# EAGLE board 090559_Sceptre (EAGLE 5.10)
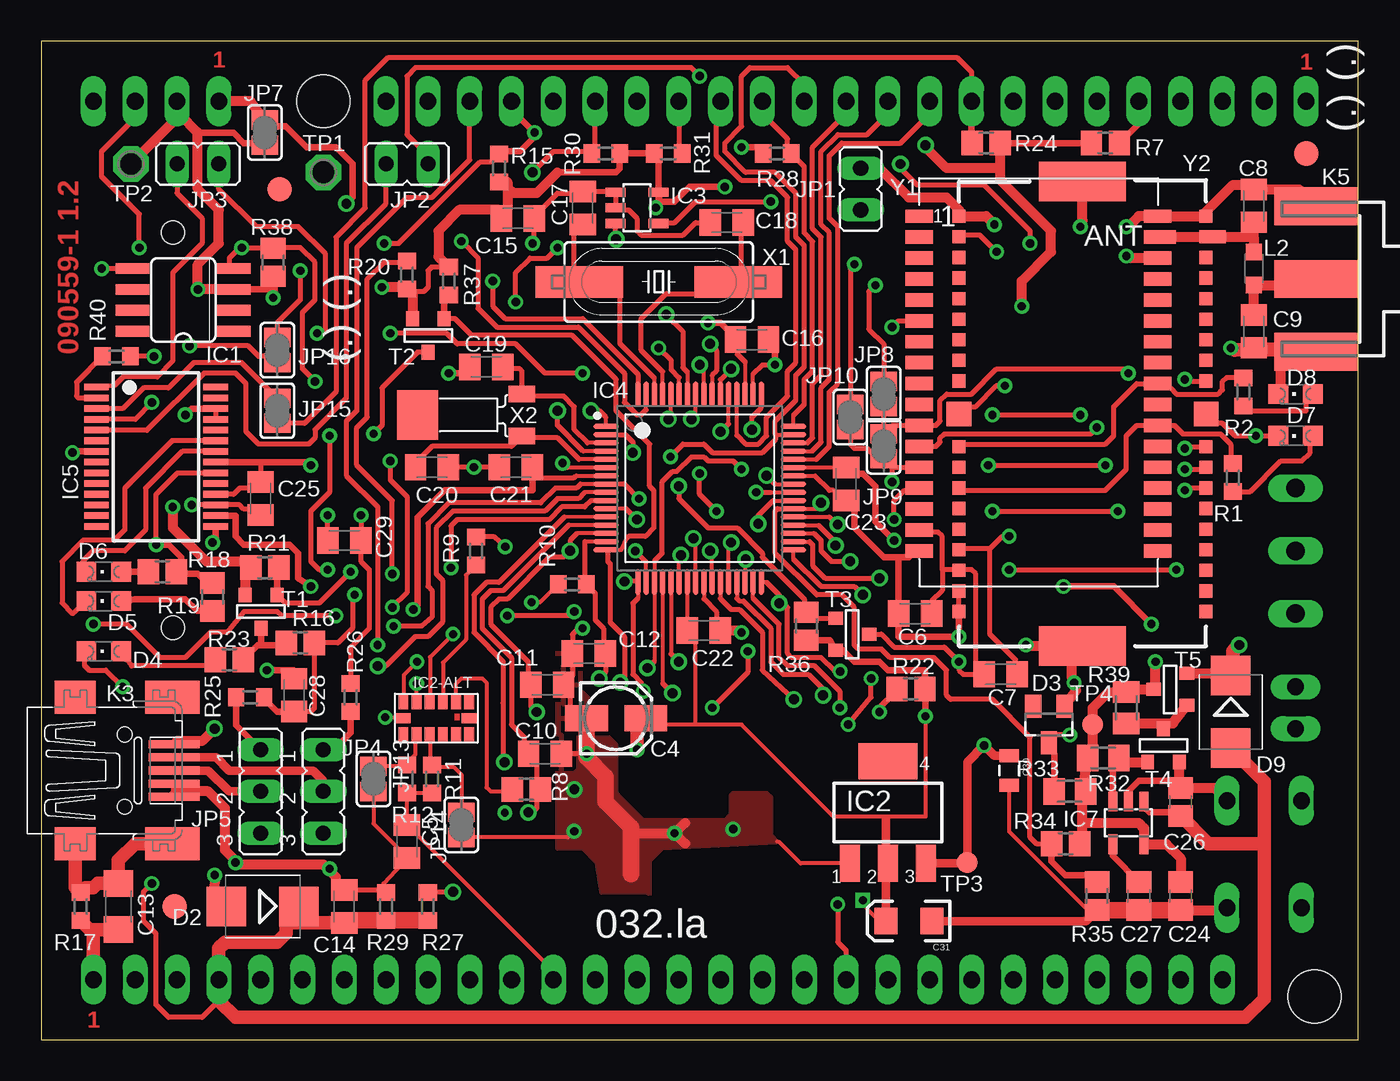
[diagram p7: board, top side]
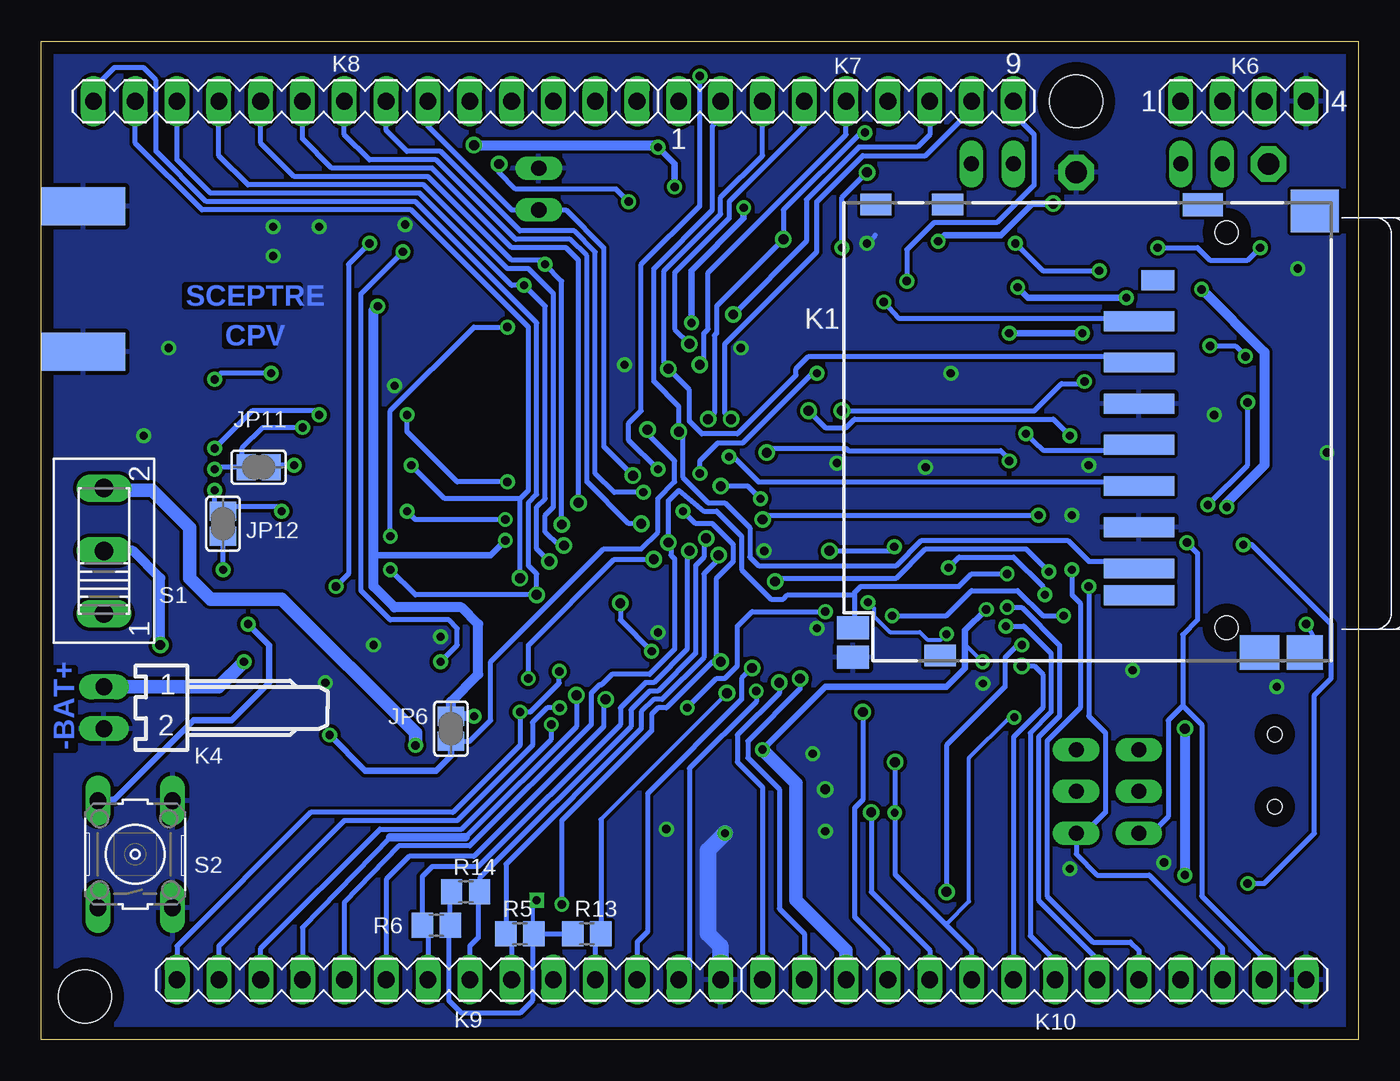
[diagram p8: board, bottom side, seen from below]

Size 80 x 60.63 mm. Coordinates in mm from the lower left corner, seen from the top.
Outline: 0,0 79.99,0 79.99,60.63 0,60.63 0,0
Copper layers (1*16): Top 0.035mm / dielectric 1.5mm / Bottom 0.035mm
Design rules "default *": minimum track width 10mil, minimum drill 19mil, track to track 8mil, track to pad 7mil, pad to pad 6mil, via to via 8mil, smd to smd 8mil, copper to edge 30mil, drill to drill 8mil, minimum pad ring 10mil, minimum via ring 8mil, stop-mask expansion 4mil, vias tented up to drill 20mil, thermal gap 10mil
Net classes: 1 +5V: width 1.016 mm, drill 0.61 mm, clearance 0.61 mm; 2 +3V3: width 0.762 mm, drill 0.508 mm
Holes 3.2 mm at 17.14,56.98 77.34,2.63

## Footprints (pad centres in the part's own frame; a part is rotated, then mirrored left to right if it is on the bottom)
153CLV-0405 = smd 2.6 x 1.6: + 1.8,0; - -1.8,0
C0805K = smd 1.3 x 1.6: 1 -1,0; 2 1,0
C1206 = smd 1.6 x 1.8: 1 -1.4,0; 2 1.4,0
C0805 = smd 1.3 x 1.5: 1 -0.85,0; 2 0.85,0
0805 = smd 0.8 x 1.2: 1 -0.9,0; 2 0.9,0
EIA3216 = smd 1.4 x 1.6: A 1.4,0; C -1.4,0
SMB = smd 2.4 x 2.4: A 2.2,0; C -2.2,0
SOT23 = smd 1 x 1.4: 1 -0.95,-1.1; 2 0.95,-1.1; 3 0,1.1
CHIPLED_0805 = smd 1.2 x 1.2: A 0,-1.05; C 0,1.05
SO08 = smd 0.66 x 2.032: 1 -1.905,-3.073; 2 -0.635,-3.073; 3 0.635,-3.073; 4 1.905,-3.073; 5 1.905,3.073; 6 0.635,3.073; 7 -0.635,3.073; 8 -1.905,3.073
SOT223 = smd 1.219 x 2.235: 1 -2.311,-3.099; 2 0,-3.099; 3 2.311,-3.099 | smd 3.6 x 2.2: 4 0,3.099
LGA14 = smd 0.9 x 0.6: 1 1,-2; 2 1,-1.2; 3 1,-0.4; 4 1,0.4; 5 1,1.2; 6 1,2; 8 -1,2; 9 -1,1.2; 10 -1,0.4; 11 -1,-0.4; 12 -1,-1.2; 13 -1,-2 | smd 0.6 x 0.9: 7 0,2; 14 0,-2
SOT23-5L = smd 0.55 x 1.2: 1 -0.95,-1.3; 2 0,-1.3; 3 0.95,-1.3; 4 0.95,1.3; 5 -0.95,1.3
TSQFP50P1200X1200X160-64N = smd 1.55 x 0.3: 1 -5.7,3.75; 2 -5.7,3.25; 3 -5.7,2.75; 4 -5.7,2.25; 5 -5.7,1.75; 6 -5.7,1.25; 7 -5.7,0.75; 8 -5.7,0.25; 9 -5.7,-0.25; 10 -5.7,-0.75; 11 -5.7,-1.25; 12 -5.7,-1.75; 13 -5.7,-2.25; 14 -5.7,-2.75; 15 -5.7,-3.25; 16 -5.7,-3.75; 33 5.7,-3.75; 34 5.7,-3.25; 35 5.7,-2.75; 36 5.7,-2.25; 37 5.7,-1.75; 38 5.7,-1.25; 39 5.7,-0.75; 40 5.7,-0.25; 41 5.7,0.25; 42 5.7,0.75; 43 5.7,1.25; 44 5.7,1.75; 45 5.7,2.25; 46 5.7,2.75; 47 5.7,3.25; 48 5.7,3.75 | smd 0.3 x 1.55: 17 -3.75,-5.7; 18 -3.25,-5.7; 19 -2.75,-5.7; 20 -2.25,-5.7; 21 -1.75,-5.7; 22 -1.25,-5.7; 23 -0.75,-5.7; 24 -0.25,-5.7; 25 0.25,-5.7; 26 0.75,-5.7; 27 1.25,-5.7; 28 1.75,-5.7; 29 2.25,-5.7; 30 2.75,-5.7; 31 3.25,-5.7; 32 3.75,-5.7; 49 3.75,5.7; 50 3.25,5.7; 51 2.75,5.7; 52 2.25,5.7; 53 1.75,5.7; 54 1.25,5.7; 55 0.75,5.7; 56 0.25,5.7; 57 -0.25,5.7; 58 -0.75,5.7; 59 -1.25,5.7; 60 -1.75,5.7; 61 -2.25,5.7; 62 -2.75,5.7; 63 -3.25,5.7; 64 -3.75,5.7
SSOP28 = smd 0.4 x 1.5: 1 -4.225,-3.625; 2 -3.575,-3.625; 3 -2.925,-3.625; 4 -2.275,-3.625; 5 -1.625,-3.625; 6 -0.975,-3.625; 7 -0.325,-3.625; 8 0.325,-3.625; 9 0.975,-3.625; 10 1.625,-3.625; 11 2.275,-3.625; 12 2.925,-3.625; 13 3.575,-3.625; 14 4.225,-3.625; 15 4.225,3.625; 16 3.575,3.625; 17 2.925,3.625; 18 2.275,3.625; 19 1.625,3.625; 20 0.975,3.625; 21 0.325,3.625; 22 -0.325,3.625; 23 -0.975,3.625; 24 -1.625,3.625; 25 -2.275,3.625; 26 -2.925,3.625; 27 -3.575,3.625; 28 -4.225,3.625
JP1 = drill 0.914 long: 1 0,-1.27; 2 0,1.27
JP2 = drill 0.914 long: 1 -2.54,0; 2 0,0; 3 2.54,0
SJ = smd 1.168 x 1.6: 1 -0.762,0; 2 0.762,0
SDBMF-009XXBXX2 = smd 1.2 x 4.3: 1 6.7,5.325; 2 4.2,5.325; 3 1.7,5.325; 4 -0.8,5.325; 5 -3.3,5.325; 6 -5.8,5.325; 7 -8.3,5.325; 8 -9.925,5.325 | smd 1.2 x 2: 9 9.2,4.175 | smd 1.397 x 2.413: 10 13.787,1.457 | smd 2.1 x 2.4: M1 -13.4,-2 | smd 2.6 x 2.9: M2 13.4,-5.35 | smd 1.3 x 1.9: M3 -13.6,17.4; M4 13.8,16.95; M5 13.8,21.3 | smd 1.4 x 1.95: SW1 -11.9,22.7; SW3 -13.7,22.7 | smd 2.1 x 2.2: SW2 -13.4,-4.75 | hole 1.4: -11.9,0; 12.1,0
32005-201 = smd 3.1 x 0.5: 1 3,1.6; 2 3,0.8; 3 3,0; 4 3,-0.8; 5 3,-1.6 | smd 2.5 x 2: M1 -3,-4.45; M2 -3,4.45 | smd 3.3 x 2: M3 2.9,4.45; M4 2.9,-4.45 | hole 0.9: 0,2.2; 0,-2.2
7395-02 = drill 1.016 long: 1 1.27,0; 2 -1.27,0
J502-ND-142-0701-871/876 = smd 5.08 x 2.286: 1 2.565,0; G@1 2.565,4.42; G@2 2.565,-4.42 | smd 5.08 x 2.286 bottom: G@3 2.565,4.42; G@4 2.565,-4.42
MA04-1 = drill 1.016 long: 1 -3.81,0; 2 -1.27,0; 3 1.27,0; 4 3.81,0
MA09-1 = drill 1.016 long: 1 -10.16,0; 2 -7.62,0; 3 -5.08,0; 4 -2.54,0; 5 0,0; 6 2.54,0; 7 5.08,0; 8 7.62,0; 9 10.16,0
MA14-1 = drill 1.016 long: 1 -15.24,0; 2 -12.7,0; 3 -10.16,0; 4 -7.62,0; 5 -5.08,0; 6 -2.54,0; 7 0,0; 8 2.54,0; 9 5.08,0; 10 7.62,0; 11 10.16,0; 12 12.7,0; 13 15.24,0; 14 17.78,0
L2012C = smd 1 x 1: 1 -1,0; 2 1,0
R0603 = smd 1 x 1.1: 1 -0.85,0; 2 0.85,0
R0805 = smd 1.3 x 1.5: 1 -0.85,0; 2 0.85,0
M0805 = smd 1.3 x 1.6: 1 -0.95,0; 2 0.95,0
255SB = drill 1.118 long: 1 -3.81,0; 2 0,0; 3 3.81,0
B3F-10XX = drill 1.016 long: 1 -3.251,2.261; 2 3.251,2.261; 3 -3.251,-2.261; 4 3.251,-2.261
SOT-23 = smd 0.787 x 0.889: 1 0.025,-1.016; 2 -0.94,1.016; 3 0.991,1.016
P1-13 = drill 1.321 pad 2.159 octagon: TP 0,0
B1,27 = smd 1.27 x 1.27: TP 0,0
FIDUCIAL-1.5X3 = smd 1.5 x 1.5: 1 0,0
HC49UP = smd 5.334 x 1.93: 1 -4.826,0; 2 4.826,0
WATCH_XTAL_1 = smd 1.6 x 1: P$1 0,1.27; P$2 0,-1.27 | smd 2.5 x 3: P$3 -6.35,0
BTM-112 = smd 1.676 x 0.813: 1 0,20.32; 2 0,19.05; 3 0,17.78; 4 0,16.51; 5 0,15.24; 6 0,13.97; 7 0,12.7; 8 0,11.43; 9 0,10.16; 10 0,8.89; 11 0,7.62; 12 0,6.35; 13 0,5.08; 14 0,3.81; 15 0,2.54; 16 0,1.27; 17 0,0; 18 14.478,0; 19 14.478,1.27; 20 14.478,2.54; 21 14.478,3.81; 22 14.478,5.08; 23 14.478,6.35; 24 14.478,7.62; 25 14.478,8.89; 26 14.478,10.16; 27 14.478,11.43; 28 14.478,12.7; 29 14.478,13.97; 30 14.478,15.24; 31 14.478,16.51; 32 14.478,17.78; 34 14.478,20.32 | smd 1.93 x 0.813: 33 14.605,19.05
BTM-22X = smd 0.8 x 0.8: 1 0,0; 2 0,-1.25; 3 0,-2.5; 4 0,-3.75; 5 0,-5; 6 0,-6.25; 7 0,-7.5; 8 0,-8.75; 9 0,-10; 11 0,-14; 12 0,-15.25; 13 0,-16.5; 14 0,-17.75; 15 0,-19; 16 0,-20.25; 17 0,-21.5; 18 0,-22.75; 19 0,-24; 20 15,-24; 21 15,-22.75; 22 15,-21.5; 23 15,-20.25; 24 15,-19; 25 15,-17.75; 26 15,-16.5; 27 15,-15.25; 28 15,-14; 30 15,-10; 31 15,-8.75; 32 15,-7.5; 33 15,-6.25; 34 15,-5; 35 15,-3.75; 36 15,-2.5; 38 15,0 | smd 1.5 x 1.5: 10 0,-12; 29 15,-12 | smd 1.6 x 0.8: 37 15.4,-1.25 | smd 5.3 x 2.4: 39 7.5,2.1; 40 7.5,-26.1

## Placement (x,y rotation side)
C4  4u7 6V3  [153CLV-0405]  34.92,19.52 0 top
C5  100n  [C0805K]  22.22,12.03 270 top
C6  100n  [C0805K]  53.08,25.87 0 top
C7  220n  [C0805K]  58.29,22.19 180 top
C8  [C0805K]  73.66,50.64 90 top
C9  [C0805K]  73.66,43.02 270 top
C10  100n  [C0805K]  30.6,17.36 180 top
C11  100n  [C0805K]  30.73,21.55 180 top
C12  100n  [C0805K]  33.27,23.46 0 top
C13  10n 500V  [C1206]  4.69,8.09 270 top
C14  100n  [C0805K]  18.41,8.09 270 top
C15  100n  [C0805K]  28.95,49.87 180 top
C16  100n  [C0805K]  43.17,42.51 0 top
C17  18p  [C0805K]  32.89,50.51 90 top
C18  18p  [C0805K]  41.65,49.62 180 top
C19  22p  [C0805K]  27.05,40.86 180 top
C20  22p  [C0805K]  23.74,34.76 0 top
C21  100n  [C0805K]  28.82,34.76 180 top
C22  100n  [C0805K]  40.25,24.85 0 top
C23  100n  [C0805K]  48.89,33.74 270 top
C24  1u  [C0805]  69.21,8.73 270 top
C25  100n  [C0805K]  13.33,32.86 270 top
C26  1u  [C0805]  69.21,14.44 90 top
C27  1u  [C0805]  66.67,8.73 270 top
C28  18p  [C0805K]  15.36,20.92 90 top
C29  18p  [C0805K]  18.41,30.32 180 top
C30  [0805]  58.8,16.34 270 top
C31  [EIA3216]  52.7,7.2 180 top
D2  MBRS130LT3  [SMB]  13.46,8.09 180 top
D3  BZX84C39  [SOT23]  61.21,19.14 180 top
D4  [CHIPLED_0805]  3.8,23.58 90 top
D5  [CHIPLED_0805]  3.8,26.63 90 top
D6  [CHIPLED_0805]  3.8,28.41 90 top
D7  [CHIPLED_0805]  76.19,36.66 90 top
D8  [CHIPLED_0805]  76.19,39.2 90 top
D9  MBRS130LT3  [SMB]  72.26,19.9 270 top
IC1  DS18B20Z  [SO08]  8.63,44.92 90 top
IC2  [SOT223]  51.43,13.8 0 top
IC2-ALT  MMA7361L  [LGA14]  24,19.52 90 top
IC3  LM3724-3V08  [SOT23-5L]  36.19,50.51 270 top
IC4  LPC2148FBD64  [TSQFP50P1200X1200X160-64N]  40,33.49 0 top
IC5  FT232RL  [SSOP28]  6.98,35.4 270 top
IC7  MAX1551  [SOT23-5L]  66.03,13.17 180 top
JP1  ISP  [JP1]  49.78,51.65 180 top
JP2  ISP_RX  [JP1]  22.22,53.17 270 top
JP3  ISP_TX  [JP1]  9.52,53.17 270 top
JP4  [JP2]  17.14,15.08 270 top
JP5  [JP2]  13.33,15.08 270 top
JP6  [SJ]  55.11,18.89 90 bottom
JP7  [SJ]  13.58,55.08 270 top
JP8  [SJ]  51.18,39.2 90 top
JP9  [SJ]  51.18,36.03 270 top
JP10  [SJ]  49.14,37.81 90 top
JP11  [SJ]  66.8,34.76 0 bottom
JP12  [SJ]  68.96,31.33 270 bottom
JP13  [SJ]  20.19,15.84 270 top
JP14  [SJ]  25.52,13.04 270 top
JP15  [SJ]  14.35,38.19 270 top
JP16  [SJ]  14.35,41.87 90 top
K1  SDBMF-00915B0T2  [SDBMF-009XXBXX2]  8,36.92 90 bottom
K3  MINI-USB-SCHIELD-32005-201  [32005-201]  5.08,16.34 0 top
K4  22-05-7028-02  [7395-02]  76.19,20.16 90 bottom
K5  SMA-142-0701-801  [J502-ND-142-0701-871/876]  80,46.19 180 top
K6  [MA04-1]  6.98,56.98 0 bottom
K7  [MA09-1]  31.11,56.98 0 bottom
K8  [MA14-1]  61.59,56.98 0 bottom
K9  [MA14-1]  53.97,3.64 180 bottom
K10  [MA14-1]  18.41,3.64 180 bottom
L2  [L2012C]  73.66,46.83 90 top
R1  1k  [R0603]  72.38,34.12 90 top
R2  1k  [R0603]  73.02,39.33 90 top
R5  4k7  [R0805]  50.92,6.44 180 bottom
R6  4k7  [R0805]  56,6.95 180 bottom
R7  NC / DNP  [R0805]  64.64,54.45 0 top
R8  1k  [R0805]  29.46,15.2 0 top
R9  1k  [R0603]  26.41,29.68 90 top
R10  1k  [R0603]  32.25,27.65 0 top
R11  100k  [R0603]  23.74,15.84 270 top
R12  100k  [R0603]  22.22,15.84 270 top
R13  100k  [R0805]  46.86,6.44 0 bottom
R14  100k  [R0805]  54.22,8.98 0 bottom
R15  47k  [R0603]  27.81,52.92 90 top
R16  1k5  [R0805]  15.74,24.09 0 top
R17  1M  [R0603]  2.41,8.09 270 top
R18  1k  [R0805]  7.36,28.41 0 top
R19  1k  [R0805]  10.41,26.89 270 top
R20  1M  [R0603]  22.22,46.44 90 top
R21  1M  [R0805]  13.58,28.66 0 top
R22  1M  [R0805]  52.83,21.3 180 top
R23  1k  [R0805]  11.43,23.08 180 top
R24  4k7  [R0805]  57.4,54.45 180 top
R25  33 R  [R0603]  12.7,20.79 0 top
R26  33 R  [R0603]  18.79,20.79 90 top
R27  10k  [R0603]  23.49,8.09 270 top
R28  100k  [R0603]  44.7,53.81 0 top
R29  100k  [R0603]  20.95,8.09 90 top
R30  100k  [R0603]  34.28,53.81 180 top
R31  100k  [R0603]  38.09,53.81 0 top
R32  100k  [M0805]  64.51,17.11 180 top
R33  1k  [M0805]  62.48,15.08 180 top
R34  330k  [R0805]  62.23,11.9 0 top
R35  1M  [R0805]  64.13,8.73 90 top
R36  1M  [R0805]  46.48,25.11 90 top
R37  1M  [R0603]  24.76,46.06 270 top
R38  4k7  [R0805]  14.09,47.21 270 top
R39  100k  [M0805]  65.91,20.16 90 top
R40  2k2  [R0603]  4.57,41.49 180 top
S1  PWR  [255SB]  76.19,29.68 90 bottom
S2  [B3F-10XX]  74.29,11.27 90 bottom
T1  ZXM61P03F  [SOT-23]  13.33,26 0 top
T2  ZXM61P03F  [SOT-23]  23.49,42.76 0 top
T3  ZXM61P03F  [SOT-23]  49.27,24.6 90 top
T4  FDV301N  [SOT-23]  68.19,17.87 180 top
T5  ZXM61P03F  [SOT-23]  68.58,21.3 270 top
TP1  TPSQPAD1-13  [P1-13]  17.14,52.67 0 top
TP2  TPSQPAD1-13  [P1-13]  5.46,53.17 0 top
TP3  TPSQB1,27  [B1,27]  56.26,10.76 0 top
TP4  TPSQB1,27  [B1,27]  63.88,19.14 0 top
U$1  FIDUCIAL1.5X3  [FIDUCIAL-1.5X3]  8.12,8.09 0 top
U$2  FIDUCIAL1.5X3  [FIDUCIAL-1.5X3]  76.83,53.81 0 top
U$3  FIDUCIAL1.5X3  [FIDUCIAL-1.5X3]  14.47,51.65 0 top
X1  12 MHz  [HC49UP]  37.51,46.01 180 top
X2  32.768 kHz  [WATCH_XTAL_1]  29.2,37.94 0 top
Y1  BTM-112  [BTM-112]  53.34,29.68 0 top
Y2  BTM-222  [BTM-22X]  55.75,50 0 top

## Tracks (layer width: path | path; a pad name or v marks a point on that pad's centre or on a via)
+3V3  (via drill 0.48, 0.5, 0.6)
  Top 0.254: 42.75,41.15 IC4.51 | 39.25,25.1 IC4.23 | 32.49,34.24 IC4.7 | C23.1 IC4.43 | v22.83,22.95 22.02,22.14 22.02,20.54 IC2-ALT.6 | R11.2 23.74,15 22.22,15 R12.2 C5.1 22.32,12.97 31.01,4.28 K10.12 31.11,4.92 | IC2.2 51.43,7.33 C31.A 50.92,7.2 50.16,7.96 50.16,8.22 v49.91,8.47 | 39.75,19.14 42.54,19.14 48.13,13.55 51.43,13.55 | 39.75,19.14 37.1,19.14 C4.+ | 39.75,24.36 C22.1 39.75,24.24 39.75,19.14 | 51.43,13.55 53.72,13.55 v53.72,19.65 | 51.43,13.55 51.3,13.42
  Top 0.305: 42.75,41.15 42.29,41.62 42.29,42.4 C16.1 41.78,43.02 | T3.2 48.69,23.66 | C22.1 39.25,25.1 | R37.1 23.7,46.91 23.49,46.7 23.49,45.68 23.24,45.43 22.39,45.43 R20.1 | 32.49,34.24 32.38,34.12 30.35,34.12 30.35,34.24 C21.1 | R38.2 14.09,45.43 13.96,45.55 | IC3.5 37.46,50.92 | 49.26,34.38 C23.1
  Top 0.406: R36.1 47.91,24.26 T3.2 | 13.96,45.55 IC1.3 | 31.36,52.67 34.92,52.67 35.13,52.88 R30.1 R31.1 37.49,53.56 IC3.5 | 48.69,23.66 49.4,22.95 50.92,22.95 51.43,22.44 53.68,22.44 R22.1 53.72,21.3 v53.72,19.65 | v51.81,30.32 50.67,31.46 50.67,33.62 49.91,34.38 49.26,34.38 | 27.81,50.38 27.95,50.24 C15.2 27.95,50.02 28.32,50.38 | R15.1 28.32,52.07 | R24.1 R7.1 | 22.39,45.43 22.55,45.26 | v40.51,43.52 41.27,43.52 41.78,43.02 | IC3.5 37.49,50.67 v37.33,50.51 | 9.52,55.08 11.68,55.08 12.31,54.45 13.33,54.45 JP7.2 | R20.1 22.13,45.68 | v42.54,54.19 43.72,54.19 R28.1 | v22.6,26.12 22.86,26.38 22.86,31.71 24.51,33.36 29.84,33.36 29.84,34.74 C21.1 | v41.52,51.78 39.37,51.78 38.48,50.89 37.55,50.89 IC3.5
  Top 0.508: 51.3,13.42 C31.A
  Top 0.61: IC1.3 v9.52,45.55 9.52,47.08 10.79,48.35 10.79,50.38 9.52,51.65 9.52,55.08 8.44,56.16 | 8.44,56.16 8.25,56.35 K6.2 | R15.1 28.74,51.4 30.09,51.4 31.36,52.67 | 27.81,50.38 25.39,50.38 24.12,49.11 24.12,47.55 R37.1 | 28.32,52.07 28.32,50.38 | v59.56,44.54 59.56,46.06 61.34,47.84 61.34,49.11 58.25,52.2 58.25,52.92 | 58.25,52.92 R24.1 | 22.55,45.26 T2.2 | v14.09,45.05 R38.2 | 22.13,45.68 v20.7,45.68 | v8,32.35 8,31.08 10.03,29.05 12.35,29.05 R21.1 12.39,28.32 T1.2 | v53.72,54.32 53.84,54.06 54.99,52.92 58.25,52.92 | 8.44,56.16 TP2.TP
  Top 0.813: v36.19,17.62 36.19,18.99 C4.+
  Bottom 0.254: v22.83,22.95 23.72,23.84 23.9,23.84 | 50.16,6.35 50.16,8.22 v49.91,8.47
  Bottom 0.305: R14.1 55.15,8.9 R6.1 55.15,6.53 55.24,6.44 55.24,2.38 54.48,1.61 50.92,1.61 50.16,2.38 50.16,6.35 R5.1 R13.1
  Bottom 0.406: v51.81,30.32 52.7,29.43 59.81,29.43 | v40.51,43.52 40.51,46.7 37.33,49.87 v37.33,50.51 | v14.09,45.05 20.06,45.05 v20.7,45.68 | 8,32.6 v8,32.35 | v41.52,51.78 41.52,53.17 v42.54,54.19 | v22.6,26.12 23.9,24.85 23.9,23.84 23.9,22.54 25.01,21.43 32.38,21.43 v36.19,17.62
  Bottom 0.61: v53.72,19.65 JP6.2 55.11,20.54 53.46,22.19 53.46,25.23 54.48,26.25 58.54,26.25 59.81,27.52 59.81,29.43 59.81,44.29 v59.56,44.54 | 8,32.6 5.71,34.89 5.71,41.75 v9.52,45.55 | v42.54,54.19 42.67,54.32 v53.72,54.32
  Bottom 0.813: v36.19,17.62 34.16,15.58 34.16,8.47 31.11,5.42 K10.12
+5V  (via drill 0.5)
  Top 0.305: IC5.20 8.29,34.42 6.98,33.11 v6.98,30.06 | v6.73,9.49 6.22,8.98 6.22,7.2 6.98,6.44 6.98,2.12 7.74,1.36 9.77,1.36 10.79,2.38
  Top 0.406: IC7.1 67.02,14.44 67.02,14.1 67.31,13.8 69,13.8 C26.1 | v6.98,30.06 7.74,30.06 8.5,29.3 8.5,28.45 R18.2 8.59,28.28 9.52,28.28 10.07,27.74 R19.1
  Top 0.813: 74.29,11.9 74.29,2.5 73.15,1.36 11.81,1.36 10.79,2.38 K10.4 10.79,5.55 11.17,5.93 14.35,5.93 14.89,6.48 14.89,7.46 | 14.89,7.46 D2.C | C14.2 15.26,7.09 14.89,7.46 | 74.29,11.9 70.9,11.9 C26.1 | 74.29,11.9 74.29,15.67 D9.A
  Top 1.016: C14.2 18.56,7.24 R29.1 R27.2
  Bottom 0.305: v6.98,30.06 6.47,30.06 1.65,25.23 1.65,21.93 2.66,20.92 2.66,12.54 5.71,9.49 v6.73,9.49
/POK
  Top 0.406: IC7.3 65.09,16.98 R32.1
  Top 0.61: T4.3 65.46,16.85 R32.1
ANTENNA
  Top 0.61: K5.1 77.08,45.83 L2.1 C9.1
BATTERY  (via drill 0.5)
  Top 0.406: IC7.5 66.98,11.8
  Top 0.61: 63.24,13.17 66.67,13.17 66.98,12.86 IC7.5 68.35,11.87 69.21,11.01 C24.1 | 63.24,13.17 63.24,15.01 R33.1 63.31,15.21 R32.2 63.88,17.42 TP4.TP 63.88,20.16 64.83,21.11 R39.2 65.82,21.27 T5.1 67.69,21.4 v67.69,22.95 | R34.2 63.24,12.07 63.24,13.17
  Bottom 0.813: K4.1 69.21,21.43 v67.69,22.95
BT_RESET  (via drill 0.5)
  Top 0.305: v51.68,43.27 52.06,43.65 Y1.6 | Y2.16 55.82,29.82 57.64,29.82 | 57.64,29.82 57.64,24.62 59.18,23.08 59.18,22.3 C7.1 | 57.64,29.82 58.38,30.57 v58.8,30.57
  Bottom 0.305: v58.8,30.57 58.8,38.19 53.72,43.27 v51.68,43.27
D+  (via drill 0.5)
  Top 0.305: IC4.10 33.41,32.74 33.02,32.35 31.62,32.35 30.86,31.59 25.27,31.59 24.89,31.2 v24.89,28.66 | C28.1 15.38,19.9 16.38,19.9 16.59,20.12 R16.2 18.03,24.09 18.92,24.98 18.92,26.89 v19.05,27.01
  Top 0.406: R25.2 13.55,20.7 14.35,19.9 15.35,19.9 C28.1
  Bottom 0.305: v19.05,27.01 19.17,27.27 19.17,27.52 20.95,29.3 24.25,29.3 v24.89,28.66
D-  (via drill 0.5, 0.6)
  Top 0.254: 35.53,32.24 IC4.11
  Top 0.305: v36.19,31.59 35.53,32.24 | R26.2 18.79,23.84 19.93,24.98 19.93,28.54 19.41,29.06 C29.1 19.44,31.57 v19.43,31.84
  Bottom 0.305: v36.19,31.59 35.81,31.84 v19.43,31.84
DNEG  (via drill 0.5)
  Top 0.406: IC5.16 11.82,31.82 11.81,30.57 12.31,30.06 15.11,30.06 15.62,29.55 15.62,28.03 v16.38,27.52
  Bottom 0.305: K10.3 8.25,5.55 12.7,10 15.87,10 17.14,11.27 JP4.3 16.63,12.54 15.36,13.8 15.36,18.63 16.38,19.65 v16.38,27.52
DPOS  (via drill 0.5)
  Top 0.406: IC5.15 10.61,30.13 v10.41,30.19
  Bottom 0.305: 10.66,20.28 11.55,19.39 11.55,13.55 12.31,12.79 13.08,12.79 JP5.3 | K10.2 5.71,4.92 9.52,8.73 9.52,19.14 10.66,20.28 | 10.66,20.28 10.66,24.6 9.77,25.49 9.77,29.55 v10.41,30.19
GND  (via drill 0.48, 0.5, 0.6)
  Top 0.254: IC4.25 40.25,26.76 | IC4.6 31.94,34.74 | 47.01,34.23 45.71,34.23 | IC4.50 43.25,40.42 | IC4.59 38.75,40.2 | IC4.18 36.75,29.02 | v22.8,21.63 IC2-ALT.5 | 20.8,9.09 20.8,9.48 C5.2 22.17,11.14 20.19,13.12 JP13.2 | JP14.2 32,12.28 v32.38,12.66 | C30.2 58.8,12.64 63.5,7.94 R35.1 | C31.C 54.12,7.2 | IC2.1 46.12,10.71 44.85,11.98 44.7,12.03
  Top 0.305: C14.1 20.8,9.09 R29.2 | IC5.18 11.69,33.12 12.06,33.49 12.96,33.49 C25.1 13.33,35.07 | IC5.26 IC5.25 | C16.2 44.06,42.4 44.17,42.4 | Y2.19 Y2.18 | 53.21,29.81 Y1.17 | C20.2 v26.28,34.76 C21.2 | 40.25,26.76 41.02,26 41.02,24.87 C22.2 | 31.94,34.74 v31.67,35.01 | C11.1 31.51,21.77 | 33.12,17.36 C10.1 | C11.1 31.73,21.31 32.13,20.92 32.13,20.16 32.38,19.9 32.74,19.9 C4.- | C11.1 32.27,22.09 C12.1 32.27,24.62 32.63,24.98 v32.89,24.98 | IC1.5 v3.68,46.83 | C29.2 v17.39,31.84 | 45.71,34.23 IC4.42 | 47.01,34.23 47.87,33.36 48.13,33.36 48.75,33 C23.2 49.4,32.49 | C18.2 39.75,49.62 38.98,48.86 36.44,48.86 36.19,49.11 36.19,49.87 35.68,50.38 35.02,50.38 IC3.2 IC3.1 34.84,51.51 C17.2 32.78,51.4 31.36,51.4 29.95,49.98 C15.1 29.95,48.46 v29.84,48.35 | D4.C 2.63,23.2 2.63,22.73 2.92,22.44 3.93,22.44 v4.95,21.43 | Y2.10 56.19,38.44 56.76,38.44 58.03,39.71 v58.54,39.71 | 43.25,40.42 43.81,40.98 v44.57,40.98 | 38.75,40.2 38.27,40.68 38.27,41.24 v37.51,42 | 36.75,29.02 v36.09,29.68 | Y2.29 70.75,37.92 71.24,37.43 71.75,37.43 72.51,36.66 v73.78,36.66 D7.C | 16.31,35.07 16.31,34.96 v16.38,34.89
  Top 0.406: IC7.2 66.03,15.08 66.67,15.71 69.04,15.71 C26.2 | 71.89,7.88 S2.3 | K3.4 K3.5 8.07,14.9 | 53.21,29.81 52.7,29.3 52.08,29.3 | 49.4,32.49 49.4,31.08 51.18,29.3 52.08,29.3 | Y2.19 v55.75,24.47 52.08,24.47 C6.1 52.08,29.3 | 59.88,23.9 v59.81,23.97 | C19.2 25.66,40.73 25.66,40.62 25.52,40.48 v24.76,40.48 | C28.2 15.35,22.43 v13.71,22.44 | 44.17,42.4 44.57,42 v44.57,40.98 | IC5.7 1.97,35.72 v1.9,35.65 | 16.31,35.07 13.33,35.07 IC5.21 | Y1.17 53.46,29.68 | IC5.26 9.14,38.32 v8.76,37.94
  Top 0.508: C31.C 63.46,7.2 R35.1
  Top 0.61: S2.4 71.26,15.29 C26.2 69.13,15.37 T4.2 | C24.2 71.89,7.88 | K5.G@4 76.41,51.64 C8.2 73.38,51.91 72.38,51.91 70.48,50 Y2.38 Y1.34 66.67,50 66.03,49.37 v65.91,49.37 | 8.07,14.9 8.25,15.08 10.16,15.08 11.17,14.06 11.17,11.52 11.87,10.82 | 11.87,10.82 12.06,10.63 17.14,10.63 17.9,9.87 17.9,9.6 C14.1 | v57.91,49.49 57.4,50 Y2.1 55.75,50.38 54.99,51.14 52.7,51.14 50.92,52.92 JP1.1 | v38.48,12.54 39.11,13.17 | v38.48,12.54 39.11,11.9 | 35.83,12.54 v38.48,12.54 | 59.88,23.9 Y2.40 63.05,23.9 62.61,23.46 62.61,21.93 62.86,21.68 62.86,21.19 D3.1 | v63.11,49.37 63.25,49.74 Y2.39 | 11.87,10.82 v11.81,10.76 | C22.2 42.41,24.85 v42.54,24.73 | 75.31,42.02 C9.2 73.64,42 v72.26,42 72.49,41.77 K5.G@3 77.19,42.02 75.31,42.02 | D8.C 75.15,39.3 75.31,39.46 75.31,42.02 | Y1.32 66.03,47.46 v65.91,47.59
  Top 0.813: C13.2 3.17,6.69 | 3.17,6.69 2.96,6.69 R17.2 | 3.17,6.69 K10.1
  Top 1.016: R35.1 C27.2 C24.2 | C4.- 33.12,17.36 33.12,17.15 34.28,15.98 34.28,14.44 35.83,12.9 35.83,12.54 35.83,10.05
  Bottom 0.305: S2.4 72.03,14.72 | v26.28,34.76 26.41,34.63 | v17.39,31.84 17.65,31.6 | v4.95,21.43 4.69,21.43 | v29.84,48.35 29.33,48.86 | v32.89,24.98 32.89,25.23
  Bottom 0.61: v57.91,49.49 58.03,49.37
  Bottom 1.016: v38.48,12.54 39.49,11.52 39.49,6.44 38.73,5.68 K9.1
  other vias: 62.74,21.68 33.14,17.36 32.38,15.2 42.03,12.79 17.52,10.38
  pour Bottom: 0.12,60.54 79.88,60.54 79.88,0.09 0.12,0.09
  pour Top: 31.36,24.09 31.36,11.65 32.89,11.65 33.78,10.76 34.03,8.98 36.83,8.98 36.95,8.85 36.95,10.88 37.71,11.65 44.7,12.03 44.32,12.41 44.32,14.69 44.06,14.95 42.03,14.95 41.91,14.82 41.91,13.68 41.52,13.3 36.57,13.3 34.92,14.95 34.92,17.87 34.03,18.76 34.03,19.9 32.76,21.17 32.76,23.97 31.49,23.97
N$1
  Top 0.254: IC2-ALT.2 25.22,20.54 25.22,21.63 25.52,21.93 26.79,21.93 27.05,21.68 27.05,15.33 27.3,15.08 28.48,15.08 R8.1 28.59,15.2
N$2
  Top 0.813: K3.M4 5.7,11.89 4.69,10.88 C13.1 3.43,9.49 3.17,9.23 2.7,9.23 R17.1 2.08,9.27 K3.M1
N$3
  Top 0.254: IC2-ALT.3 24.4,22.9 25.8,24.3 25.8,28.21 26.41,28.82 R9.1
N$5  (via drill 0.48)
  Top 0.254: v25.01,24.62 23.62,23.23 23.62,20.54 IC2-ALT.4 | v29.79,26.56 30.3,26.56 31.39,27.65 R10.1
  Bottom 0.254: v25.01,24.62 25.34,24.3 26.18,24.3 26.64,24.75 28.44,24.75 29.41,25.72 29.41,26.18 v29.79,26.56
N$7
  Top 0.61: R39.1 67.94,19.21 | 67.94,19.21 68.74,19.21 T5.3 | T4.1 67.91,19.18 67.94,19.21
N$8
  Top 0.406: IC7.4 65.09,11.16 C27.1
N$9
  Top 0.406: R25.1 11.84,19.1 JP5.1
N$10
  Top 0.406: R26.1 18.79,18.63 17.77,17.62 JP4.1
N$11
  Top 0.406: 13.33,23.97 14.77,23.97 R16.1 | T1.1 13.36,23.99 13.33,23.97 | 13.33,23.97 13.16,23.97 R23.1
N$12
  Top 0.305: R1.1 73.44,33.27 75.31,35.14 76.58,35.14 77.08,35.65 77.08,36.5 D7.A
N$13
  Top 0.305: R2.1 73.23,38.48 73.53,38.19 76.83,38.19 76.83,38.79 D8.A
N$14
  Top 0.508: K3.2 10.62,17.15 11.43,16.34 16.5,16.34 17.14,15.71 JP4.2
N$15
  Top 0.508: K3.3 10.16,16.34 11.43,15.08 JP5.2
N$17
  Top 0.305: 5.11,23.08 D4.A 5.49,22.7 10.03,22.7
  Top 0.406: R23.2 10.41,23.08 10.03,22.7
N$18
  Top 0.305: IC5.3 4.95,38.32 6.22,39.59 7.74,39.59 9.27,41.11 12.19,41.11 JP15.1
N$19
  Top 0.305: JP2.1 20.95,50.76 18.54,48.35 18.54,38.95 16.63,37.05 16.63,36.54 16.25,36.16 13.2,36.16 12.44,36.92 12.44,39.84 11.81,40.48 9.9,40.48 6.42,37 3.53,37 IC5.5
N$20
  Top 0.305: JP3.1 8.25,51.4 9.77,49.87 9.77,48.35 8,46.57 8,41.24 7.06,40.25 4.97,40.25 4.44,39.71 3.4,39.61 IC5.1
N$21
  Top 0.305: IC5.2 2.26,38.97 2.15,39.08 2.15,39.93 R40.2
N$22  (via drill 0.5)
  Top 0.305: v20.19,36.79 20.7,37.3 20.7,39.59 22.86,41.75 T2.1
  Bottom 0.305: 20.06,36.66 v20.19,36.79 19.14,35.8 13.3,35.8 13.08,36.03 12.75,36.31 K1.4
N$23  (via drill 0.5)
  Top 0.305: C7.2 56.78,22.33 | 54.73,28.54 54.73,27.27 54.08,26.62 C6.2 | 54.73,28.54 54.73,30.57 54.48,30.82 53.46,30.82 Y1.16 53.21,31.08 | 54.73,28.54 55.71,28.54 Y2.17 55.78,28.54 56.51,28.54 56.76,28.28 56.76,22.93 C7.2 | Y2.2 55.86,48.86 57.02,48.86 v58.03,47.84 | T3.1 51.02,24.62 51.81,23.84 54.86,23.84 v55.75,22.95 55.75,22.44 56,22.19 C7.2
  Bottom 0.305: v58.03,47.84 60.57,45.3 60.57,27.27 58.8,25.49 55.24,25.49 54.73,24.98 54.73,23.97 v55.75,22.95
N$24  (via drill 0.6)
  Top 0.61: T5.2 72.38,22.24 D9.C
  Top 0.813: 72.38,22.24 72.38,23.57 v72.77,23.97
  Bottom 0.61: v72.77,23.97 72.77,28.03 74.42,29.68 S1.2
N$25  (via drill 0.5)
  Top 0.305: v6.85,41.49 R40.1 | v9.01,42.13 12.57,42.13 13.2,41.49 13.96,41.49 JP16.1
  Bottom 0.305: v9.01,42.13 7.49,42.13 v6.85,41.49
N$28
  Top 0.254: JP13.1 22.14,16.6 R12.1 | 22.78,18.5 IC2-ALT.9 22.73,18.33 22.73,17.31 22.32,16.9 R12.1 | R12.1 22.27,16.8
N$29
  Top 0.254: IC2-ALT.10 23.62,18.5 23.62,16.83 23.74,16.7 R11.1 23.8,16.57 25.04,16.57 25.52,16.09 JP14.1
N$35  (via drill 0.5)
  Top 0.305: C25.2 12.96,32.22 12.31,32.22 12.06,32.47 IC5.17 9.52,32.47 9.27,32.47 v9.14,32.47 | IC5.4 5.72,37.67 v6.73,38.7
  Bottom 0.305: v6.73,38.7 6.73,34.89 v9.14,32.47
N$39
  Top 0.305: D5.C 1.9,25.87 1.27,26.51 1.27,29.05 2.53,30.32 4.44,30.32 5.08,30.95 5.08,33.49 7.95,36.37 IC5.23
N$40
  Top 0.305: D6.C 2.76,28.83 2.53,29.05 3.17,29.68 5.08,29.68 6.34,30.95 6.34,33.49 8.57,35.72 IC5.22
N$41
  Top 0.406: D6.A R18.1
N$42
  Top 0.406: D5.A 5.11,26.67 5.71,26.76 8.76,26.76 9.48,26.04 R19.2
N$47  (via drill 0.5, 0.6)
  Top 0.305: v60.07,48.35 60.07,49.11 57.27,51.91 53.21,51.91 52.19,52.92 v52.19,53.17 | IC3.4 37.55,49.62 38.48,49.62 39.75,50.89 v44.32,50.89
  Top 0.406: v67.43,25.23 65.15,27.52 v62.1,27.52
  Bottom 0.305: v60.07,48.35 61.34,47.08 61.34,28.28 v62.1,27.52 | v44.32,50.89 45.08,51.65 51.18,51.65 52.19,52.67 v52.19,53.17
  Bottom 0.406: S2.2 76.58,14.54 76.32,14.57 75.56,14.57 70.73,19.39 68.45,19.39 66.16,21.68 66.16,23.97 v67.43,25.23
N$48  (via drill 0.5, 0.6)
  Top 0.406: 8.25,18.12 K3.1
  Top 0.61: D2.A 10.5,8.94 v10.54,10 | v10.54,18.89 9.77,18.12 8.25,18.12
  Bottom 0.61: v10.54,18.89 v10.54,10
N$52
  Top 0.254: IC4.61 37.75,40.57
  Top 0.305: 37.75,40.57 36.44,41.87 36.44,43.78 37.97,45.3 42.13,45.3 X1.1 42.54,45.71 42.54,48.86 C18.1
N$53
  Top 0.254: IC4.62 37.25,40.18
  Top 0.305: 32.38,45.96 32.23,45.96 | 37.25,40.18 35.17,42.25 35.17,45.3 32.89,45.3 X1.2 32.38,45.81 32.38,45.96 | C17.1 32.74,49.25 32.38,49.11 32.38,45.96
N$54
  Top 0.254: IC4.5 32.66,35.24
  Top 0.305: 32.66,35.24 31.36,36.54 29.33,36.54 X2.P$2 28.57,36.03 23.74,36.03 22.74,35.03 C20.1
N$55
  Top 0.254: IC4.3 33.19,36.24
  Top 0.305: 33.19,36.24 32.38,37.05 32.38,38.44 31.74,39.08 29.33,39.08 X2.P$1 29.2,40.6 29.08,40.73 28.43,40.73 C19.1
P0.0  (via drill 0.5, 0.6)
  Top 0.254: 37.26,29.1 37.26,27.89 | IC4.19 37.25,22.99
  Top 0.305: JP2.2 23.49,53.68 22.22,54.95 22.22,58.51 22.73,59.02 39.49,59.02 v40,58.51 | 37.26,29.1 37.71,29.55 37.71,33.87 38.35,34.51 38.6,34.51 39.49,35.4 40.25,35.4 40.51,35.14 42.03,35.14 v42.54,34.63 | 37.26,27.89 IC4.19 | 37.25,22.99 v36.83,22.57
  Bottom 0.305: v36.83,22.57 37.46,21.93 37.46,20.66 43.17,14.95 43.17,6.57 43.81,5.93 K9.3 | v40,58.51 40,50.64 43.56,47.08 43.56,38.19 44.32,37.43 44.32,36.41 v42.54,34.63
P0.1  (via drill 0.5, 0.6)
  Top 0.254: IC4.21 38.25,23.43
  Top 0.305: v48.38,8.22 48.38,5.93 48.89,5.42 K9.5 | v41.02,32.09 40,33.11 v40,34.38 | v32.89,40.48 30.6,40.48 28.82,42.25 25.27,42.25 24.63,42.89 v21.2,42.89 | JP3.2 10.79,51.65 13.08,49.37 15.62,49.37 17.27,47.71 17.27,43.14 v16.76,42.89 | 38.25,23.43 v38.73,22.95
  Bottom 0.305: v48.38,8.22 48.38,13.3 42.92,18.76 42.92,19.77 42.54,20.16 42.03,20.16 39.24,22.95 v38.73,22.95 38.98,23.2 38.98,28.03 37.97,29.05 37.97,30.06 39.24,31.33 40.25,31.33 v41.02,32.09 | v40,34.38 40,35.14 38.91,36.23 37.38,36.23 33.14,40.48 v32.89,40.48
  Bottom 0.406: v21.2,42.89 v16.76,42.89
P0.2  (via drill 0.6)
  Top 0.254: IC4.22 38.75,29.41
  Top 0.305: 38.75,29.41 v38.86,29.43
  Bottom 0.305: v38.86,29.43 38.73,29.3 39.75,28.28 39.75,23.2 42.29,20.66 42.79,20.66 43.56,19.9 43.56,18.89 51.77,10.67 R5.2 51.43,6.1 K9.6
P0.3  (via drill 0.6)
  Top 0.254: IC4.26 40.75,29.57
  Top 0.305: 40.75,29.57 v40.63,29.68
  Bottom 0.305: K9.8 56.51,6.61 R6.2 56.85,9.91 56.26,10.5 53.46,10.5 44.83,19.14 44.83,20.16 43.3,21.68 42.79,21.68 40.76,23.71 40.76,29.55 v40.63,29.68
P0.4  (via drill 0.6)
  Top 0.254: IC4.27 41.25,26.78
  Top 0.305: 41.25,26.78 41.91,26.12 42.41,26.12 43.81,24.73 43.81,22.44 v45.72,20.66
  Bottom 0.305: K9.9 59.05,9.74 57.65,11.14 53.72,11.14 45.84,19.01 45.84,20.41 v45.72,20.66
P0.5  (via drill 0.6)
  Top 0.254: IC4.29 42.25,26.8
  Top 0.305: 42.25,26.8 42.38,26.67 42.67,26.63 44.32,24.98 44.32,22.95 45.08,22.19 46.6,22.19 47.49,21.3 v47.49,20.92
  Bottom 0.305: 58.8,12.28 64.13,6.82 K9.11 | v47.49,20.92 47.49,19.01 54.22,12.28
  Bottom 0.508: 54.22,12.28 58.8,12.28
P0.6  (via drill 0.5, 0.6)
  Top 0.254: 42.75,29.13 IC4.30
  Top 0.305: v42.79,29.17 42.75,29.13 | v49.02,19.14 50.41,20.79 v50.41,21.93
  Bottom 0.305: K9.12 66.67,5.55 59.43,12.79 54.48,12.79 49.02,18.25 v49.02,19.14 | v50.41,21.93 50.41,23.97 45.21,29.17 v42.79,29.17
P0.7  (via drill 0.5)
  Top 0.254: 43.25,26.81 IC4.31
  Top 0.305: 43.25,26.81 44.83,25.23 44.83,23.2 45.33,22.7 46.98,22.7 48.51,21.17 v48.51,20.16
  Bottom 0.305: K9.13 69.21,5.68 61.59,13.3 54.73,13.3 50.16,17.87 50.16,19.27 49.27,20.16 v48.51,20.16
P0.8  (via drill 0.5, 0.6)
  Top 0.254: 45.7,29.19 IC4.33
  Top 0.305: v58.8,28.54 v68.96,28.54 | 45.7,29.19 47.37,27.52 49.4,27.52 v49.91,27.01
  Bottom 0.305: K8.1 76.83,57.75 75.56,59.02 73.78,59.02 73.02,58.26 73.02,53.94 69.97,50.89 57.27,50.89 49.91,43.52 49.91,33.11 50.41,32.6 50.41,28.79 49.91,28.28 v49.91,27.01 57.27,27.01 v58.8,28.54 | v68.96,28.54 JP12.2
P0.9  (via drill 0.5, 0.6)
  Top 0.254: IC4.34 46.68,30.24
  Top 0.305: IC4.34 | v57.53,34.89 v64.64,34.89 | 46.68,30.24 46.86,30.06 46.86,28.79 47.62,28.03 v50.92,28.03
  Bottom 0.305: 50.92,32.86 50.41,33.36 50.41,43.27 57.53,50.38 70.23,50.38 74.29,54.45 K8.2 | JP11.2 65.91,34.89 v64.64,34.89 | 50.92,32.86 55.49,32.86 v57.53,34.89 | v50.92,28.03 50.92,32.86
P0.10  (via drill 0.5, 0.6)
  Top 0.254: IC4.35 45.69,30.75 46.93,30.75
  Top 0.305: JP8.2 51.18,42.25 50.28,43.15 50.28,45.44 v50.67,45.81 | 46.93,30.75 47.37,30.32 47.37,29.68 48,29.05 v49.14,29.05
  Bottom 0.305: K8.3 71.75,53.43 69.72,51.4 57.02,51.4 51.43,45.81 v50.67,45.81 49.4,44.54 49.4,32.86 49.91,32.35 49.91,29.81 v49.14,29.05
P0.11  (via drill 0.5, 0.6)
  Top 0.254: IC4.37 47.87,31.74
  Top 0.305: v49.4,47.08 49.14,46.83 JP10.2 | 47.87,31.74 v48.38,31.28
  Top 0.406: R7.2 66.67,55.63 K8.5
  Bottom 0.305: K8.5 66.67,54.45 64.64,52.41 56.51,52.41 51.43,47.33 49.65,47.33 v49.4,47.08 48.38,46.06 v48.38,31.28
P0.12  (via drill 0.6)
  Top 0.254: 45.68,32.22 IC4.38 47.11,32.25
  Top 0.305: R34.1 60.45,11.9 60.07,12.28 60.07,18.38 57.78,20.66 55.24,20.66 54.99,20.92 54.99,22.44 54.22,23.2 51.56,23.2 51.05,23.71 49.65,23.71 49.4,23.97 49.4,26.25 48.64,27.01 47.11,27.01 44.57,29.55 44.57,32.09 44.72,32.24 IC4.38 | 47.11,32.25 v47.37,32.6
  Top 0.406: R34.1 61.38,10.85 62.23,10 63.71,10 R35.2
  Bottom 0.305: K8.6 64.13,54.7 62.35,52.92 56.26,52.92 51.43,48.09 48.13,48.09 47.37,47.33 v47.37,32.6
P0.13  (via drill 0.6)
  Top 0.254: 44.46,32.74 IC4.39
  Top 0.305: v43.56,31.33 43.56,31.84 44.46,32.74
  Bottom 0.305: v43.56,31.33 44.32,31.33 46.86,33.87 46.86,47.59 47.87,48.6 51.18,48.6 56,53.43 60.07,53.43 61.59,54.95 K8.7
P0.14  (via drill 0.6)
  Top 0.254: 44.58,33.74 IC4.41
  Top 0.305: v44.06,34.25 44.58,33.74 | JP15.2 16,37.43 17.9,39.33 17.9,48.73 19.68,50.51 19.68,58.26 21.08,59.65 55.62,59.65 56.51,58.76 K8.9
  Top 0.406: R24.2 56.51,54.48 K8.9
  Bottom 0.305: K8.9 56.51,55.46 51.43,50.38 JP1.2 48.13,50.38 45.84,48.09 45.84,36.03 v44.06,34.25
P0.15
  Top 0.254: IC4.45 46.82,35.74
  Top 0.305: 46.82,35.74 47.37,36.28 47.37,39.59 47.87,40.09 47.87,48.98 47.37,49.49 47.37,53.94 48.38,54.95 50.16,54.95 51.43,56.22 K8.11
P0.16
  Top 0.254: IC4.46 46.56,36.24
  Top 0.305: 46.56,36.24 46.86,36.54 46.86,39.84 47.37,40.35 47.37,48.73 46.86,49.24 46.86,54.19 48.89,56.22 K8.12
P0.17  (via drill 0.5)
  Top 0.254: 44.62,36.74 IC4.47
  Top 0.305: K8.13 46.35,58 45.33,59.02 43.05,59.02 42.54,58.51 42.54,55.46 41.52,54.45 41.52,53.94 42.79,52.67 44.57,52.67 45.84,51.4 45.84,48.73 46.35,48.22 46.35,40.86 45.84,40.35 45.84,38.82 44.57,37.55 44.57,36.79 44.62,36.74 44.62,36.46 43.81,35.65 40.76,35.65 40.25,36.16 38.98,36.16 v38.22,35.4
  Bottom 0.305: v38.22,35.4 37.97,35.4 36.44,33.87 12.81,33.87 K1.5
P0.18  (via drill 0.6)
  Top 0.254: 41.75,37.4 IC4.53
  Top 0.305: R31.2 38.95,53.98 38.73,54.19 K7.2 | v41.27,36.92 41.75,37.4
  Bottom 0.305: K7.2 38.73,55.97 39.24,55.46 39.24,50.38 42.79,46.83 42.79,39.97 41.27,38.44 v41.27,36.92 41.02,36.66 41.02,34.12 39.49,32.6 38.48,32.6 36.95,31.08 36.95,29.3 36.44,28.79 28.06,28.79 26.54,30.32 17.65,30.32 16.38,29.05 13.08,29.05 12.82,28.79 12.64,28.54 K1.7
P0.19  (via drill 0.6)
  Top 0.254: 41.25,40.07 IC4.54
  Top 0.305: v41.91,40.73 41.25,40.07
  Bottom 0.305: K7.3 36.19,53.68 38.73,51.14 38.73,50.13 42.16,46.7 42.16,41.11 41.91,40.86 v41.91,40.73 40.63,39.46 40.63,37.55 39.87,36.79 37.71,36.79 34.16,40.35 34.16,40.73 33.4,41.49 12.93,41.49 K1.2
P0.20  (via drill 0.5, 0.6)
  Top 0.254: 40.75,40.34 IC4.55
  Top 0.305: 40.75,40.34 41.02,40.6 41.02,41.87 v40.63,42.25 | v29.84,52.67 31.11,53.94 33.56,53.94 R30.2 33.44,53.98 33.65,54.19 K7.4 | v31.36,48.09 30.86,47.56 30.73,47.46 29.69,47.46 28.82,46.6 v28.82,44.79
  Bottom 0.305: v40.63,42.25 41.52,43.14 41.52,46.57 38.22,49.87 38.22,50.89 33.65,55.46 K7.4 | v31.36,48.09 31.36,51.14 v29.84,52.67 | v28.82,44.79 27.94,43.81 13.64,43.81 K1.1
P0.21  (via drill 0.5, 0.6)
  Top 0.254: IC4.1 34.3,37.79
  Top 0.305: v17.39,28.54 16.89,28.54 16.38,29.05 16.38,32.09 17.52,33.24 v17.52,36.66 | 34.3,37.79 33.9,38.19 v33.4,38.19
  Bottom 0.305: K10.5 13.33,5.42 13.84,5.93 16.12,5.93 18.92,8.73 18.92,18.12 16.89,20.16 16.89,26.51 17.39,27.01 v17.39,28.54 | v17.52,36.66 18.54,37.68 30.6,37.68 31.11,37.17 32.38,37.17 v33.4,38.19
P0.22  (via drill 0.5, 0.6)
  Top 0.305: v21.2,35.14 21.2,34 22.22,32.98 22.22,27.14 v21.33,26.25 | v35.94,35.65 35.94,36.28 35.48,36.74 IC4.2
  Bottom 0.305: K10.6 15.87,4.92 19.43,8.47 19.43,18.38 18.16,19.65 18.16,23.97 20.44,26.25 v21.33,26.25 | v35.94,35.65 35.55,35.9 31.11,35.9 30.98,35.78 21.71,35.78 21.2,35.27 v21.2,35.14
P0.23  (via drill 0.5, 0.6)
  Top 0.254: 39.25,40.54 IC4.58
  Top 0.305: 39.25,40.54 38.98,40.8 38.98,43.02 v37.97,44.03 | R27.1 24.72,8.94 v25.01,8.98 | v20.44,23.97 20.44,32.35 18.54,34.25 18.54,37.55 19.17,38.19 19.17,48.09 22.22,51.14 23.74,51.14 26.03,53.43 K7.7
  Bottom 0.305: v37.97,44.03 33.52,48.48 33.52,51.02 30.35,54.19 26.79,54.19 26.03,54.95 K7.7 | v25.01,8.98 25.01,17.87 21.46,21.43 21.46,23.2 20.7,23.97 v20.44,23.97
P0.25  (via drill 0.6)
  Top 0.254: IC4.9 33.02,33.24
  Top 0.305: 33.02,33.24 32.63,32.86 31.36,32.86 30.6,32.09 25.01,32.09 24,31.08 24,28.28 24.38,27.9 24.38,25.36 23.49,24.47 22.73,24.47 20.95,22.7 v20.44,22.7
  Bottom 0.305: v20.44,22.7 19.68,22.7 19.17,22.19 19.17,20.16 20.95,18.38 K10.8
P0.28  (via drill 0.6)
  Top 0.254: IC4.13 32.03,31.24
  Top 0.305: 32.03,31.24 28.06,27.27 27.3,27.27 26.79,26.76 26.79,24.98 28.57,23.2 28.57,19.14 29.33,18.38 29.33,17.63 C10.2 29.55,17.31 29.64,17.31 30.09,16.85 30.09,15.42 R8.2 30.09,14.99 30.09,14.06 29.84,13.8 v29.59,13.8
  Bottom 0.305: v29.59,13.8 29.59,8.98 26.03,5.42 K10.10
P0.29  (via drill 0.5, 0.6)
  Top 0.254: 32.56,30.75 34.33,30.75 IC4.14
  Top 0.305: 32.56,30.75 32.13,30.32 v32.13,29.68 31.74,29.3 30.86,29.3 28.32,26.76 27.81,26.76 27.3,26.25 27.3,25.23 29.59,22.95 29.59,21.7 C11.2 29.73,20.27 v30.09,19.9 | R9.2 27.52,30.53 v28.19,29.93
  Bottom 0.305: v30.09,19.9 30.09,14.57 30.6,14.06 30.6,7.46 28.57,5.42 K10.11 | v32.13,29.68 28.44,29.68 v28.19,29.93
P0.30  (via drill 0.6)
  Top 0.254: 33.02,30.24 34.23,30.24 IC4.15
  Top 0.305: v33.9,21.93 34.27,22.3 C12.2 34.16,23.57 34.16,24.98 33.65,25.49 33.65,27.1 R10.2 33.02,27.74 33.02,30.24
  Bottom 0.305: v33.9,21.93 33.9,21.3 37.08,18.12 37.08,17.11 35.17,15.2 35.17,7.96 33.65,6.44 K10.13
P0.31  (via drill 0.5, 0.6)
  Top 0.254: 36.25,26.82 IC4.17 36.24,27.83
  Top 0.305: 36.25,26.82 35.94,26.51 35.94,22.19 36.44,21.68 36.44,21.43 v36.57,21.17 | 36.24,27.83 v35.43,27.83 | v18.79,28.41 16.89,26.51 14.85,26.51 14.6,26.76 T1.3
  Top 0.406: T1.3 14.32,28.55 R21.2
  Bottom 0.305: v36.57,21.17 36.57,20.54 40.63,16.47 40.63,4.28 K9.2 | v35.43,27.83 35.17,28.03 28.06,28.03 26.28,29.81 20.19,29.81 v18.79,28.41
P1.16  (via drill 0.6)
  Top 0.254: IC4.16 34.41,29.73 35.23,29.73 35.55,30.44
  Top 0.305: T2.3 25.14,43.78 26.16,42.76 32.25,42.76 34.92,40.09 34.92,38.19 36.95,36.16 36.95,33.62 37.21,33.36 37.21,31.08 36.7,30.57 35.68,30.57 35.55,30.44 | v35.17,21.68 35.43,21.93 35.43,24.47 34.55,25.35 34.55,28.9 34.41,29.05 34.41,29.63 IC4.16
  Top 0.406: R37.2 24.48,45.19 T2.3
  Bottom 0.305: v35.17,21.68 35.17,21.04 37.71,18.5 37.71,16.85 36.19,15.33 K10.14
P1.17  (via drill 0.48, 0.6)
  Top 0.254: IC4.12 31.77,31.74 | 28.06,20.03 28.06,20.41 | v28.14,16.85 27.94,16.85 | 21.81,19.52 IC2-ALT.7 21.71,19.57 v20.9,19.57
  Top 0.305: 31.77,31.74 27.81,27.78 27.05,27.78 26.28,27.01 26.28,24.73 28.06,22.95 28.06,20.92 | 28.06,20.92 28.06,20.03 28.06,16.93 v28.14,16.85 | 28.06,20.92 28.05,20.44
  Bottom 0.254: 28.14,13.78 v28.16,13.78 | v20.9,19.57 21.18,19.57 23.64,17.11 23.64,8.39 24.96,7.07 25.06,6.98
  Bottom 0.305: v28.14,16.85 28.14,13.78 28.14,10.05 25.06,6.98 23.49,5.42 K10.9
P1.18  (via drill 0.5, 0.6)
  Top 0.254: IC4.8 32.76,33.74
  Top 0.305: 32.76,33.74 32.51,33.49 31.24,33.49 30.35,32.6 24.76,32.6 23.49,31.33 23.49,27.52 23.74,27.27 23.74,25.67 23.11,25.11 v21.41,25.11 | T3.3 46.84,25.59 R36.2 46.35,26.09 46.35,26.76 43.81,29.3 43.81,29.55 42.29,31.08 40.51,31.08 38.73,32.86 v38.73,33.62 | IC4.8 35.3,33.74 35.43,33.74 v36.32,32.86
  Bottom 0.305: K10.7 18.41,4.79 19.93,6.31 19.93,18.63 18.66,19.9 18.66,23.46 20.32,25.11 v21.41,25.11 | v36.32,32.86 37.08,33.62 v38.73,33.62
P1.19  (via drill 0.5, 0.6)
  Top 0.254: IC4.4 32.92,35.74
  Top 0.305: 32.92,35.74 31.36,37.3 v31.36,38.19 | IC1.4 11.43,47.1 11.43,47.46 12.06,48.09 v12.19,48.09 12.48,48.06 R38.1 14.13,48.09 15.74,48.09 16.63,47.21 16.63,44.92 15.87,44.16 15.87,40.73 v16.63,39.97 | v5.96,48.09 5.96,50.13 3.68,52.41 3.68,53.94 5.71,55.97 K6.3
  Bottom 0.305: v31.36,38.19 19.68,38.19 18.03,39.84 16.76,39.84 v16.63,39.97 | v12.19,48.09 9.77,48.09 9.01,47.33 6.73,47.33 v5.96,48.09
P1.20
  Top 0.254: IC4.48 45.7,37.92
  Top 0.305: 45.7,37.92 46.35,38.57 46.35,40.09 46.86,40.6 46.86,48.48 46.35,48.98 46.35,53.01 R28.2 45.33,54.03 45.33,54.7 43.81,56.22 K8.14
P1.21
  Top 0.254: IC4.44 47.08,35.24
  Top 0.305: 47.08,35.24 47.87,36.03 47.87,39.33 48.38,39.84 48.38,49.37 47.87,49.87 47.87,53.68 48.64,54.45 52.19,54.45 53.97,56.22 K8.10
P1.22  (via drill 0.5)
  Top 0.254: 44.31,33.24 IC4.40
  Top 0.305: v43.43,33.24 44.31,33.24
  Bottom 0.305: v43.43,33.24 45.21,33.24 46.35,34.38 46.35,47.84 47.62,49.11 50.92,49.11 55.75,53.94 57.78,53.94 59.05,55.21 K8.8
P1.23  (via drill 0.6)
  Top 0.254: IC4.36 45.71,31.23 47.21,31.23
  Top 0.305: 47.21,31.23 48.15,30.29 v48.26,30.01
  Bottom 0.305: K8.4 69.21,53.68 67.43,51.91 56.76,51.91 51.68,46.83 50.41,46.83 48.89,45.3 48.89,32.35 49.4,31.84 49.4,30.82 48.59,30.04 v48.26,30.01
P1.24  (via drill 0.5, 0.6)
  Top 0.254: 44.06,27.78 43.77,27.78
  Top 0.305: v42.92,23.58 42.92,22.31 v40.76,20.16 | 43.77,27.78 IC4.32 | 44.06,27.78 44.83,27.01 v44.83,26.51 45.33,26.25 45.33,23.46 45.59,23.2 47.37,23.2 48.2,22.37 v48.53,22.37 | v50.92,19.9 50.96,19.94 | v3.17,25.23 5.2,25.23 7.23,23.2 8.76,23.2 10.28,24.73 11.3,24.73 12.31,26 14.35,26 14.6,25.74 v17.9,25.74 | v32.38,26 32.38,25.74 v28.32,25.74
  Top 0.406: 50.96,19.94 50.96,20.19 51.94,21.17 R22.2
  Bottom 0.305: K9.14 71.75,5.68 63.62,13.8 54.99,13.8 50.92,17.87 v50.92,19.9 50.29,19.9 48.53,21.65 v48.53,22.37 | v40.76,20.16 38.98,21.93 38.48,21.93 37.71,22.7 37.71,25.11 36.83,26 v32.38,26 | v44.83,26.51 44.83,25.49 v42.92,23.58 | K1.SW2 2.48,24.04 v3.17,25.23 | v28.32,25.74 25.01,25.74 23.49,27.27 20.7,27.27 19.17,25.74 v17.9,25.74
P1.25  (via drill 0.5, 0.6)
  Top 0.254: IC4.28 41.75,30.29
  Top 0.305: 41.75,30.29 v41.91,30.19 | R20.2 22.13,47.21 20.82,47.21 19.81,46.19 19.81,37.81 19.17,37.17 19.17,34.89 21.33,32.73 v21.33,28.28
  Bottom 0.305: K9.10 61.59,8.34 58.29,11.77 53.97,11.77 46.6,19.14 46.6,21.04 46.1,21.55 45.97,21.55 45.33,22.19 43.05,22.19 41.52,23.71 41.52,29.2 41.75,29.43 41.75,30.29 v41.91,30.19 41.91,32.73 41.27,33.36 39.75,32.09 38.98,32.09 37.46,30.57 37.46,28.54 35.68,26.76 34.92,26.76 34.67,27.01 30.6,27.01 | v21.33,28.28 23.49,28.28 24.25,27.52 30.22,27.52 30.6,27.15 30.6,27.01 | 30.6,27.01 30.6,25.11 K1.SW1
P1.26  (via drill 0.6)
  Top 0.254: IC4.24 39.75,30.31
  Top 0.305: 39.75,30.31 v39.63,30.44 v39.62,30.44
  Bottom 0.305: v39.62,30.44 39.75,30.32 39.75,29.3 40.25,28.79 40.25,23.46 42.54,21.17 43.05,21.17 44.19,20.03 44.19,19.01 53.37,9.83 R14.2 53.46,8.89 53.46,6.19 53.97,5.68 K9.7
P1.27  (via drill 0.5)
  Top 0.305: IC4.64 36.25,40.41 32.89,43.78 28.19,43.78 27.43,44.54 v27.43,46.06
  Bottom 0.305: K7.9 20.95,56.22 19.68,54.95 19.68,51.91 21.97,49.62 25.78,49.62 27.43,47.97 v27.43,46.06
P1.28  (via drill 0.6)
  Top 0.254: 38.25,38.09 IC4.60
  Top 0.305: v38.09,37.68 38.25,38.09
  Bottom 0.305: K7.8 23.49,56.48 26.28,53.68 30.09,53.68 32.89,50.89 32.89,47.84 38.48,42.25 38.48,38.06 v38.09,37.68
P1.29  (via drill 0.6)
  Top 0.254: IC4.56 40.25,40.73
  Top 0.305: 40.25,40.73 v40,40.98
  Bottom 0.305: v40,40.98 39.75,41.36 39.75,42.89 39.49,43.14 39.49,46.57 31.11,54.95 K7.5
P1.30
  Top 0.254: 42.25,36.7 IC4.52
  Top 0.305: 42.25,36.7 42.79,36.16 43.56,36.16 44.06,36.66 44.06,37.81 45.33,39.08 45.33,40.6 45.84,41.11 45.84,47.97 45.33,48.48 45.33,51.14 44.32,52.16 42.54,52.16 41.02,53.68 41.02,56.73 K7.1
P1.31  (via drill 0.6)
  Top 0.254: IC4.20 37.75,21.64
  Top 0.305: 37.75,21.64 v38.35,21.04
  Bottom 0.254: v38.35,21.04 46.01,13.39
  Bottom 0.305: K9.4 46.35,6.86 R13.2 46.01,13.39
PIO5
  Top 0.305: Y2.11 55.91,36.16 64.64,36.16 65.15,36.66 65.15,38.44 66.54,39.84 Y1.26 68.58,39.59 68.96,39.2 71.5,39.2 71.75,39.46 71.75,39.97 72,40.22 72.98,40.22 R2.2
PIO7
  Top 0.305: R1.2 72.26,35.1 72.26,36.16 71.62,36.79 69.34,36.79 68.83,37.3 Y1.24 66.54,37.3 65.91,36.66 65.91,34.63 64.64,33.36 55.88,33.36 Y2.13
RESET  (via drill 0.5, 0.6)
  Top 0.254: 39.75,37.93 IC4.57
  Top 0.305: v39.49,37.68 39.75,37.93 | IC3.3 34.89,48.76 v34.92,48.6 | JP16.2 14.35,43.52 15.74,44.92 v15.74,46.7 | v20.82,48.35 21.71,48.35 26.66,53.3 27.34,53.3 R15.2
  Top 0.406: K7.6 28.57,56.48 v29.97,55.08 29.97,54.83 29.08,53.94 27.97,53.94 R15.2
  Bottom 0.305: v39.49,37.68 39.11,38.06 39.11,42.76 38.98,42.89 38.98,44.54 v34.92,48.6 34.92,50.38 30.35,54.95 30.09,54.95 v29.97,55.08 | v15.74,46.7 19.17,46.7 v20.82,48.35
RF_IO
  Top 0.61: 73.66,48.73 L2.2 | 73.66,48.73 C8.1 | 73.66,48.73 73.63,48.75 Y2.37 67.83,48.75 Y1.33
UART_CTS  (via drill 0.5)
  Top 0.305: JP8.1 JP9.1 51.68,37.3 Y1.11 54.35,37.3 54.61,37.55 54.61,38.82 54.99,39.2 56.51,39.2 58.03,40.73 65.78,40.73 v66.03,40.48 | Y2.30 70.72,39.97 69.97,39.97 69.59,40.09 v69.46,40.09
  Bottom 0.305: v69.46,40.09 69.08,40.48 v66.03,40.48
UART_RTS  (via drill 0.5)
  Top 0.305: 51.68,34.76 Y1.13 | 51.68,34.76 JP9.2 50.92,35.27 50.8,35.4 50.67,35.4 50.16,35.9 49.4,35.9 49.14,36.16 JP10.1 | Y2.28 69.56,36 v69.46,35.9 | v57.78,37.94 v63.11,37.94 | 51.68,34.76 v51.68,33.87
  Bottom 0.305: v69.46,35.9 67.18,38.19 63.37,38.19 v63.11,37.94 | v57.78,37.94 57.78,36.92 54.73,33.87 v51.68,33.87
UART_RX  (via drill 0.5)
  Top 0.305: Y2.26 69.6,33.5 v69.46,33.36 | v57.78,32.09 v65.4,32.09 | v51.81,31.59 51.81,32.73 52.45,33.36 53.21,33.36 Y1.14
  Bottom 0.305: v69.46,33.36 69.46,32.6 JP12.1 68.7,32.35 65.65,32.35 v65.4,32.09 | v51.81,31.59 57.27,31.59 v57.78,32.09
UART_TX  (via drill 0.5)
  Top 0.305: Y1.12 54.35,36.03 54.61,36.28 54.61,36.54 54.86,36.79 63.75,36.79 v64.13,37.17 | Y2.27 70.63,34.63 v69.46,34.63
  Bottom 0.305: v69.46,34.63 69.34,34.76 67.81,34.76 | 67.81,34.76 JP11.1 | 67.81,34.76 67.81,35.9 66.54,37.17 v64.13,37.17
V+  (via drill 0.5)
  Top 0.254: TP3.TP 56.2,10.71
  Top 0.508: 56.2,10.71 IC2.3 | TP3.TP 56.26,16.85 v57.27,17.87 57.9,17.25 C30.1
  Bottom 0.813: v57.27,17.87 57.27,18.63 65.4,26.76 69.72,26.76 70.99,28.03 70.99,31.08 73.27,33.36 76.07,33.36 S1.3
VBAT  (via drill 0.5, 0.6)
  Top 0.254: 43.75,38.38 IC4.49
  Top 0.305: v62.48,18.5 61.51,18.5 D3.3 | v43.17,37.05 43.17,37.81 43.75,38.38
  Top 0.406: R33.2 61.53,17.34 D3.3
  Bottom 0.305: v43.17,37.05 43.05,36.66 41.52,35.14 41.52,33.87 42.54,32.86 42.54,30.82 43.56,29.81 45.84,29.81 52.7,22.95 52.7,19.39 53.97,18.12 JP6.1
  Bottom 0.406: JP6.1 55.11,17.23 56,16.34 60.32,16.34 v62.48,18.5
VREF  (via drill 0.5, 0.6)
  Top 0.254: 36.75,38.24 IC4.63
  Top 0.305: 36.75,38.24 36.44,37.94 36.19,37.94 35.43,38.7 35.43,40.48 32.63,43.27 27.68,43.27 26.54,44.41 26.54,47.46 v25.52,48.48
  Top 0.406: JP7.1 13.71,55.97 13.71,55.84 14.09,55.46 14.85,55.46 16.12,54.19 17.9,54.19 18.92,53.17 18.92,51.14 v18.54,50.76
  Top 0.61: K6.1 12.7,56.98 JP7.1
  Bottom 0.406: v25.52,48.48 25.14,48.86 21.71,48.86 19.81,50.76 v18.54,50.76

## Text on the board
Top: 1 | 1 | 090559-1 1.2 | 1
Bottom: SCEPTRE | CPV | -BAT+
tDocu: 4 | 1 | 9 | 1 | 14 | [NULL Space Labs] | 1 | VREF | remix by | charliex | +3V3 | GND | ISP/TX | ISP/RX | 8===> | DAT | LNK | TX | RX | CON | BAT | - BAT + | RESET | V+ | Elektor | 1 | 14 | 1 | 14
bDocu: P0.9/RX1 | P0.8/TX1 | PWR | VBAT | RESET
_tsilk: (.) (.) | (.) (.) | 032.la